# Altium schematic sheet klmag2gend-b031.SchDoc: EMMC
size A4; Date: 10.08.2025; CheckedBy: BCY; DrawnBy: miaow; DocumentNumber: 9; Revision: v0.0.1; SheetNumber: 9; SheetTotal: 12; Sample: A0; Url: github.com/miaow-cn/pcb-lib; Liscense: GPLv3; Board: MIAOW FOC BOARD; BoardType: MAIN_PCB; Desc: High speed DDR
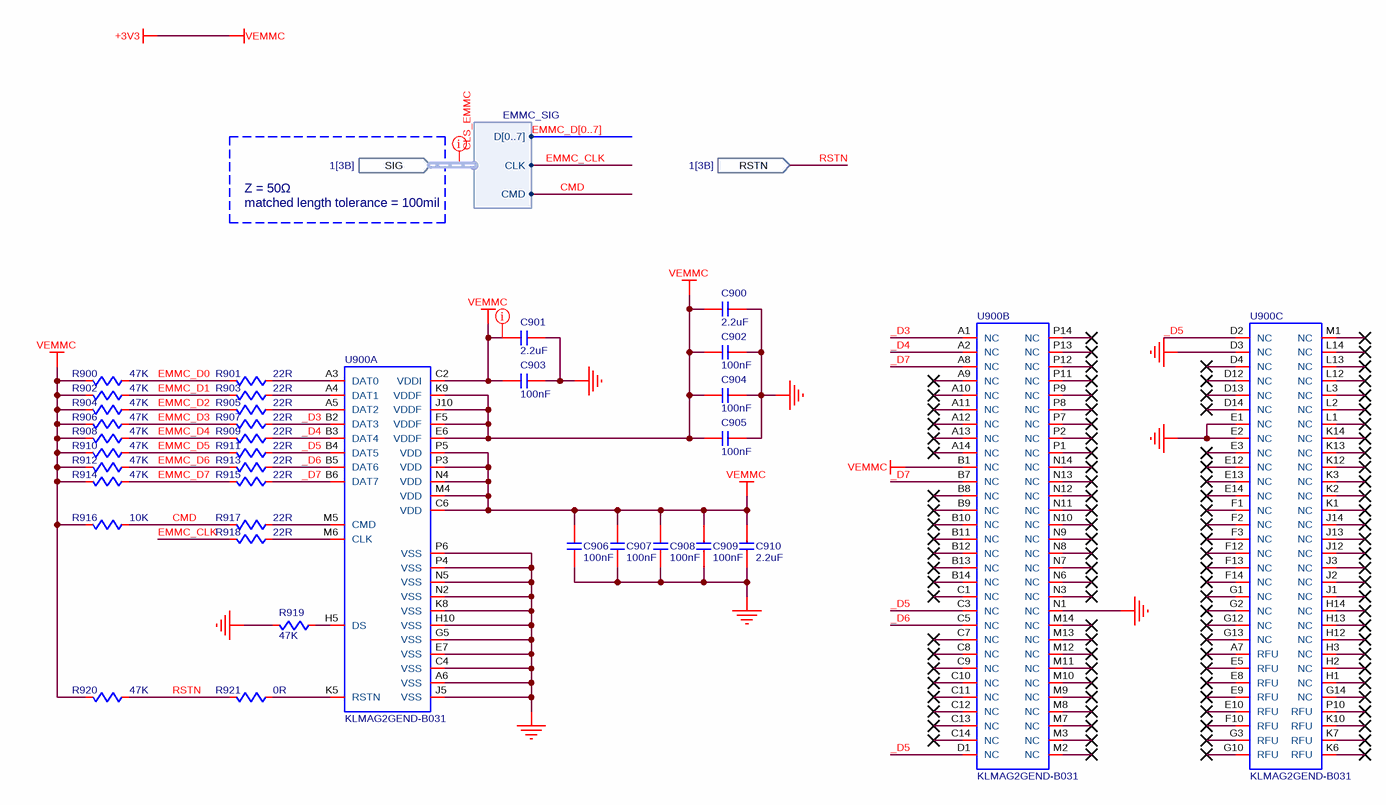
[diagram p0: klmag2gend-b031.SchDoc]

## Parts
C900  value 2.2uF  [C0603]  (hidden comment: C-NOMO)
C901  value 2.2uF  [C0603]  (hidden comment: C-NOMO)
C902  value 100nF  [C0402]  (hidden comment: C-NOMO)
C903  value 100nF  [C0402]  (hidden comment: C-NOMO)
C904  value 100nF  [C0402]  (hidden comment: C-NOMO)
C905  value 100nF  [C0402]  (hidden comment: C-NOMO)
C906  value 100nF  [C0402]  (hidden comment: C-NOMO)
C907  value 100nF  [C0402]  (hidden comment: C-NOMO)
C908  value 100nF  [C0402]  (hidden comment: C-NOMO)
C909  value 100nF  [C0402]  (hidden comment: C-NOMO)
C910  value 2.2uF  [C0603]  (hidden comment: C-NOMO)
R900  value 47K  [R0402]  (hidden comment: R)
R901  value 22R  [R0402]  (hidden comment: R)
R902  value 47K  [R0402]  (hidden comment: R)
R903  value 22R  [R0402]  (hidden comment: R)
R904  value 47K  [R0402]  (hidden comment: R)
R905  value 22R  [R0402]  (hidden comment: R)
R906  value 47K  [R0402]  (hidden comment: R)
R907  value 22R  [R0402]  (hidden comment: R)
R908  value 47K  [R0402]  (hidden comment: R)
R909  value 22R  [R0402]  (hidden comment: R)
R910  value 47K  [R0402]  (hidden comment: R)
R911  value 22R  [R0402]  (hidden comment: R)
R912  value 47K  [R0402]  (hidden comment: R)
R913  value 22R  [R0402]  (hidden comment: R)
R914  value 47K  [R0402]  (hidden comment: R)
R915  value 22R  [R0402]  (hidden comment: R)
R916  value 10K  [R0402]  (hidden comment: R)
R917  value 22R  [R0402]  (hidden comment: R)
R918  value 22R  [R0402]  (hidden comment: R)
R919  value 47K  [R0402]  (hidden comment: R)
R920  value 47K  [R0402]  (hidden comment: R)
R921  value 0R  [R0402]  (hidden comment: R)
U900  KLMAG2GEND-B031  [KLMAG2GEND-B031]  (parts A,B,C of 3)

## Ports
RSTN (in, see 1[3B]), SIG (in, harness EMMC_SIG, see 1[3B])

## Harnesses
EMMC_SIG: D[0..7], CLK, CMD

## Nets
+3V3: C900.2 C901.2 C902.2 C903.2 C904.2 C905.2 C906.2 C907.2 C908.2 C909.2 C910.2 R900.1 R902.1 R904.1 R906.1 R908.1 R910.1 R912.1 R914.1 R916.1 R920.1 U900.B1(NC) U900.C2(VDDI) U900.C6(VDD) U900.E6(VDDF) U900.F5(VDDF) U900.J10(VDDF) U900.K9(VDDF) U900.M4(VDD) U900.N4(VDD) U900.P3(VDD) U900.P5(VDD)  [also labelled VEMMC]
GND: C900.1 C901.1 C902.1 C903.1 C904.1 C905.1 C906.1 C907.1 C908.1 C909.1 C910.1 R919.1 U900.A6(VSS) U900.C4(VSS) U900.D3(NC) U900.E1(NC) U900.E2(NC) U900.E7(VSS) U900.G5(VSS) U900.H10(VSS) U900.J5(VSS) U900.K8(VSS) U900.N1(NC) U900.N2(VSS) U900.N5(VSS) U900.P4(VSS) U900.P6(VSS)
_D3: R907.2 U900.A1(NC) U900.B2(DAT3)
_D4: R909.2 U900.A2(NC) U900.B3(DAT4)
_D5: R911.2 U900.B4(DAT5) U900.C3(NC) U900.D1(NC) U900.D2(NC)
_D6: R913.2 U900.B5(DAT6) U900.C5(NC)
_D7: R915.2 U900.A8(NC) U900.B6(DAT7) U900.B7(NC)
CMD: R916.2 R917.1 ; port SIG.CMD
EMMC_CLK: R918.1 ; port SIG.CLK
EMMC_D0: R900.2 R901.1
EMMC_D1: R902.2 R903.1
EMMC_D2: R904.2 R905.1
EMMC_D3: R906.2 R907.1
EMMC_D4: R908.2 R909.1
EMMC_D5: R910.2 R911.1
EMMC_D6: R912.2 R913.1
EMMC_D7: R914.2 R915.1
RSTN: R920.2 R921.1 ; port RSTN
NetR901_2: R901.2 U900.A3(DAT0)
NetR903_2: R903.2 U900.A4(DAT1)
NetR905_2: R905.2 U900.A5(DAT2)
NetR917_2: R917.2 U900.M5(CMD)
NetR918_2: R918.2 U900.M6(CLK)
NetR919_2: R919.2 U900.H5(DS)
NetR921_2: R921.2 U900.K5(RSTN)

Not connected (* = marked no-connect by the designer): U900 A7(RFU)* A9(NC)* A10(NC)* A11(NC)* A12(NC)* A13(NC)* A14(NC)* B8(NC)* B9(NC)* B10(NC)* B11(NC)* B12(NC)* B13(NC)* B14(NC)* C1(NC)* C7(NC)* C8(NC)* C9(NC)* C10(NC)* C11(NC)* C12(NC)* C13(NC)* C14(NC)* D4(NC)* D12(NC)* D13(NC)* D14(NC)* E3(NC)* E5(RFU)* E8(RFU)* E9(RFU)* E10(RFU)* E12(NC)* E13(NC)* E14(NC)* F1(NC)* F2(NC)* F3(NC)* F10(RFU)* F12(NC)* F13(NC)* F14(NC)* G1(NC)* G2(NC)* G3(RFU)* G10(RFU)* G12(NC)* G13(NC)* G14(NC)* H1(NC)* H2(NC)* H3(NC)* H12(NC)* H13(NC)* H14(NC)* J1(NC)* J2(NC)* J3(NC)* J12(NC)* J13(NC)* J14(NC)* K1(NC)* K2(NC)* K3(NC)* K6(RFU)* K7(RFU)* K10(RFU)* K12(NC)* K13(NC)* K14(NC)* L1(NC)* L2(NC)* L3(NC)* L12(NC)* L13(NC)* L14(NC)* M1(NC)* M2(NC)* M3(NC)* M7(NC)* M8(NC)* M9(NC)* M10(NC)* M11(NC)* M12(NC)* M13(NC)* M14(NC)* N3(NC)* N6(NC)* N7(NC)* N8(NC)* N9(NC)* N10(NC)* N11(NC)* N12(NC)* N13(NC)* N14(NC)* P1(NC)* P2(NC)* P7(NC)* P8(NC)* P9(NC)* P10(RFU)* P11(NC)* P12(NC)* P13(NC)* P14(NC)*

## Buses and harness runs
bus EMMC_D[0..7]

## Layout directives
net class CLS_PWR: +3V3
net class CLS_EMMC: (no net found under the mark)

## Notes on the sheet
- Z = 50Ω
  matched length tolerance = 100mil
- DRAWN
- CHECKED
- DRAWNBY
- SHEETS
- SHEETS_NO

## Library data of the parts
C900-C910 = C-NOMO: voltage: 25V; precision: 5%
R900-R921 = R: precision: 1%
U900 = KLMAG2GEND-B031: EMMC; Supplier 1: Win Source; Supplier Part Number 1: 826874-KLMAG2GEND-B031